# EAGLE design racing_robot (EAGLE 6.1)
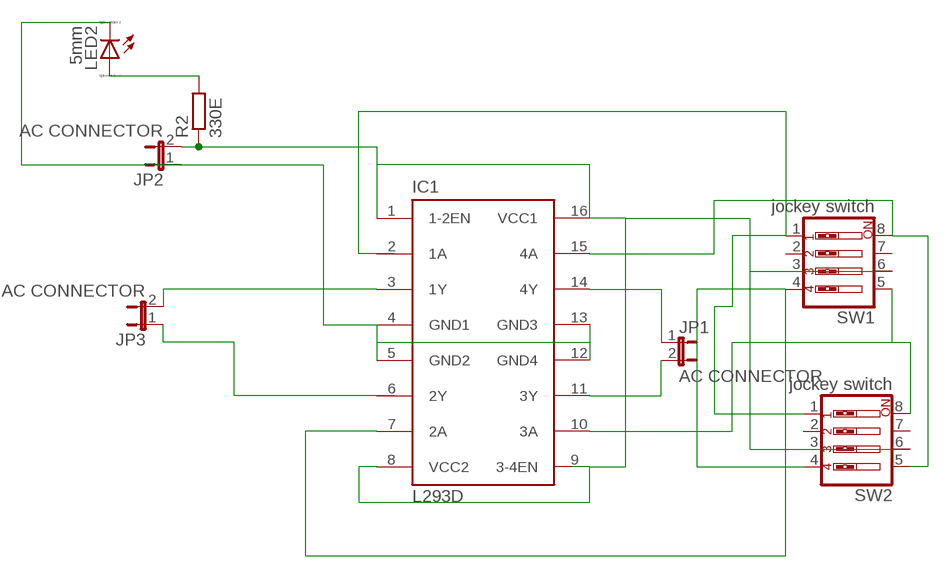
[diagram p0: schematic, sheet 1]

## Parts
IC1  L293D  [DIL16]
JP1  AC CONNECTOR  JP1E  [JP1]
JP2  AC CONNECTOR  JP1E  [JP1]
JP3  AC CONNECTOR  JP1E  [JP1]
LED2  5mm  LED_ELD260  [LED_LD260]
R2  330E  R-EU_0204/7  [0204/7]
SW1  jockey switch  SW_DIP-4  [EDG-04]
SW2  jockey switch  SW_DIP-4  [EDG-04]

## Nets
N$2: LED2.A R2.2
N$3: IC1.4(GND1) IC1.5(GND2) IC1.12(GND4) IC1.13(GND3) JP2.1 LED2.K(C)
N$4: IC1.2(1A) SW1.1 SW2.1
N$6: IC1.6(2Y) JP3.1
N$8: IC1.3(1Y) JP3.2
N$9: IC1.14(4Y) JP1.1
N$10: IC1.11(3Y) JP1.2
N$12: IC1.15(4A) SW1.8 SW2.5
N$13: IC1.7(2A) SW1.4 SW2.4
N$14: IC1.10(3A) SW1.5 SW2.8
N$15: IC1.1(1-2EN) IC1.8(VCC2) IC1.9(3-4EN) IC1.16(VCC1) JP2.2 R2.1 SW1.3 SW1.6 SW2.3 SW2.6
Unconnected: SW1.2 SW1.7 SW2.2 SW2.7

## Library data of the parts
IC1 = st-microelectronics:L293D: PUSH-PULL 4 CHANNEL DRIVER; MPN: L293D; OC_FARNELL: 9589619; OC_NEWARK: 56P8249
JP1-JP3 = jumper:JP1E: JUMPER
LED2 = eagle-ltspice:LED_E: LED Source: http://www.osram.convergy.de Source: www.luxeon.com Source: www.kingbright.com; SPICEMODEL: NONE; SPICEPREFIX: D; SPICETYPE: diode
R2 = rcl:R-EU_: RESISTOR, European symbol
SW1 SW2 = special:SW_DIP-4: DIP SWITCH

## Board
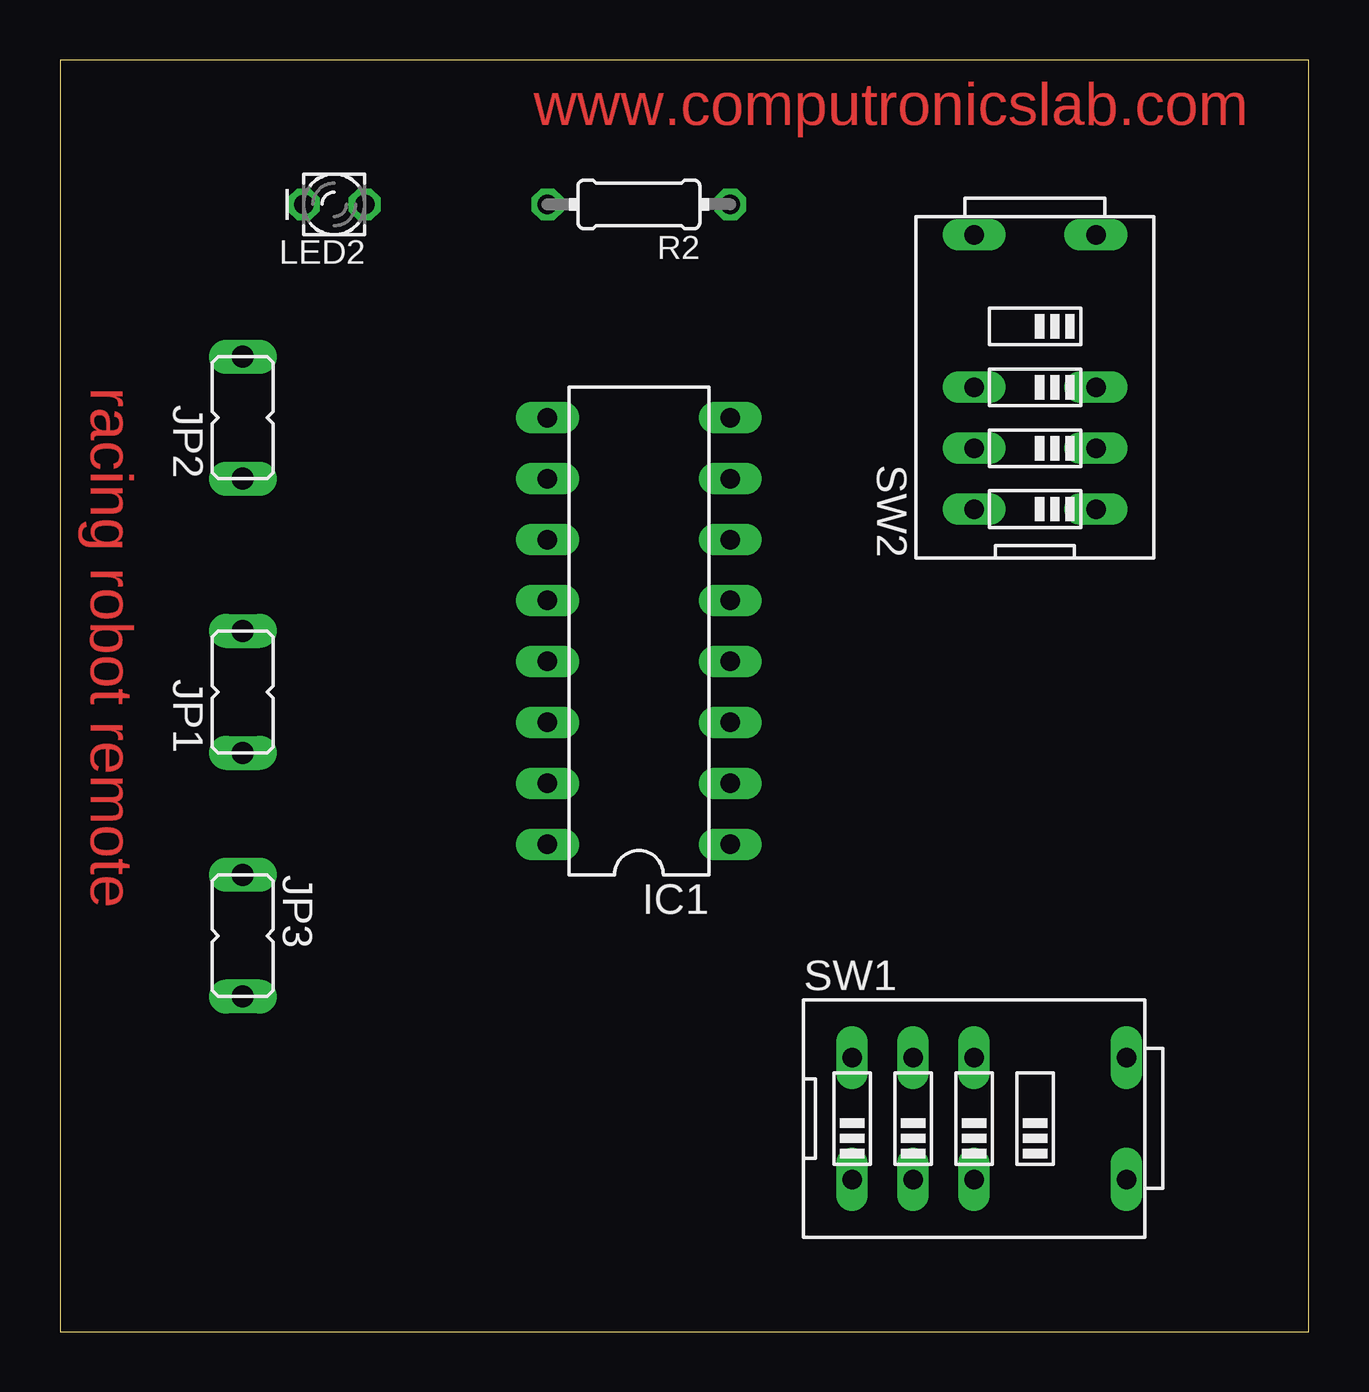
[diagram p1: board, top side]
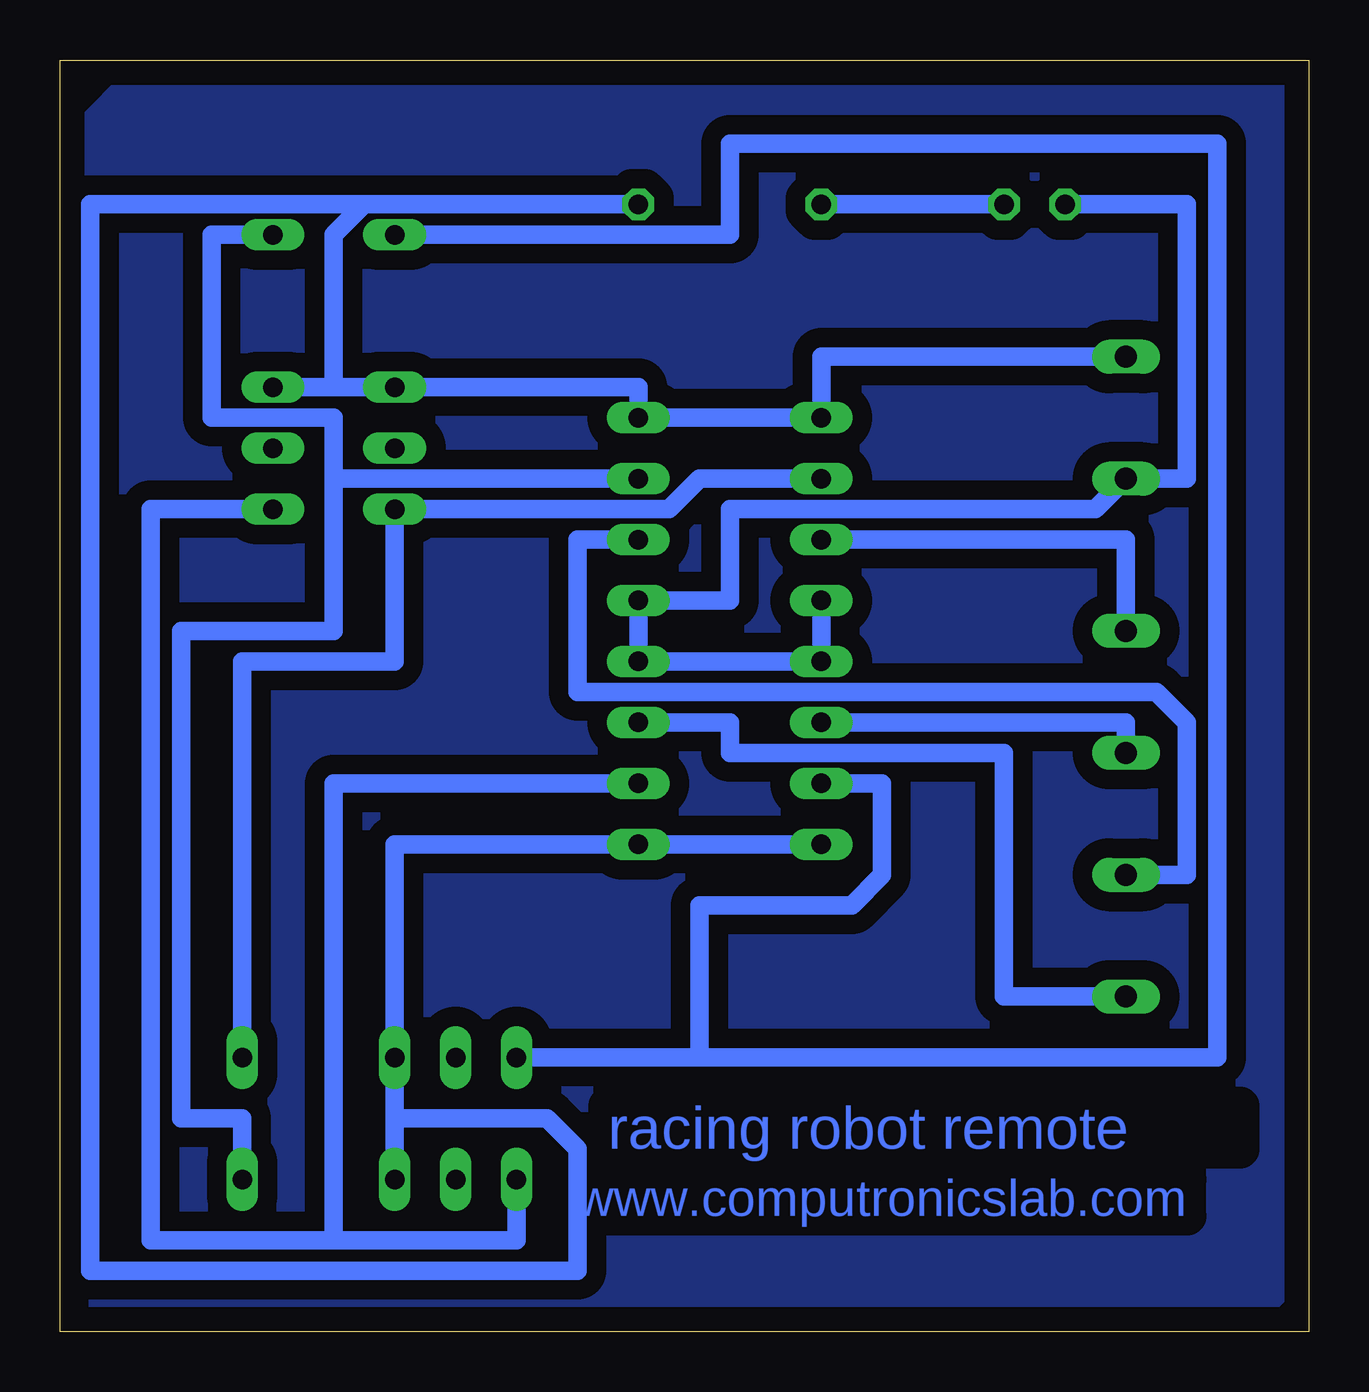
[diagram p2: board, bottom side, seen from below]

Size 52.05 x 53.01 mm. Coordinates in mm from the lower left corner, seen from the top.
Outline: 0,0 52.05,0 52.05,53.01 0,53.01 0,0
Copper layers (1*16): Top 0.035mm / dielectric 1.5mm / Bottom 0.035mm
Design rules: minimum track width 30mil, minimum drill 24mil, track to track 8mil, track to pad 8mil, pad to pad 8mil, via to via 8mil, smd to smd 8mil, copper to edge 40mil, drill to drill 8mil, minimum pad ring 10mil, minimum via ring 8mil, stop-mask expansion 4mil, vias tented up to drill 0mil, thermal gap 10mil

### Footprints (pad centres in the part's own frame; a part is rotated, then mirrored left to right if it is on the bottom)
DIL16 = drill 0.813 long: 1 -8.89,-3.81; 2 -6.35,-3.81; 3 -3.81,-3.81; 4 -1.27,-3.81; 5 1.27,-3.81; 6 3.81,-3.81; 7 6.35,-3.81; 8 8.89,-3.81; 9 8.89,3.81; 10 6.35,3.81; 11 3.81,3.81; 12 1.27,3.81; 13 -1.27,3.81; 14 -3.81,3.81; 15 -6.35,3.81; 16 -8.89,3.81
JP1 = drill 0.914 long: 1 0,-2.54; 2 0,2.54
LED_LD260 = drill 0.813 octagon: A -1.27,0; K 1.27,0
0204/7 = drill 0.813 octagon: 1 -3.81,0; 2 3.81,0
EDG-04 = drill 0.813 long: 1 -3.81,-2.54; 2 -1.27,-2.54; 3 1.27,-2.54; 4 7.62,-2.54; 5 7.62,2.54; 6 1.27,2.54; 7 -1.27,2.54; 8 -3.81,2.54

### Placement (x,y rotation side)
IC1  24.13,29.21 90 top
JP1  7.62,26.67 0 top
JP2  7.62,38.1 0 top
JP3  7.62,16.51 180 top
LED2  11.43,46.99 180 top
R2  24.13,46.99 180 top
SW1  36.83,8.89 0 top
SW2  40.64,38.1 90 top

### Tracks (layer width: path | path; a pad name or v marks a point on that pad's centre or on a via)
N$1
  pour Bottom (isolate 0.813): 7.62,0 2.54,0 0,2.54 0,50.8 2.54,53.34 48.26,53.34 52.07,49.53 52.07,2.54 49.53,0
N$2
  Bottom 0.762: R2.2 LED2.A
N$3
  Bottom 0.762: IC1.12 IC1.13 IC1.4 IC1.5 24.13,30.48 24.13,34.29 8.89,34.29 JP2.1 5.08,35.56 5.08,46.99 LED2.K
N$4
  Bottom 0.762: IC1.2 30.48,22.86 40.64,22.86 40.64,12.7 40.64,3.81 | 40.64,3.81 33.02,3.81 SW1.1 | SW2.1 46.99,34.29 48.26,34.29 48.26,3.81 40.64,3.81
N$6
  Bottom 0.762: IC1.6 30.48,33.02 30.48,26.67 6.35,26.67 5.08,25.4 5.08,19.05 JP3.1
N$8
  Bottom 0.762: IC1.3 24.13,25.4 24.13,24.13 17.78,24.13 12.7,24.13 12.7,13.97 JP3.2
N$9
  Bottom 0.762: IC1.14 7.62,25.4 JP1.1
N$10
  Bottom 0.762: IC1.11 7.62,33.02 JP1.2
N$12
  Bottom 0.762: IC1.15 17.78,22.86 17.78,21.59 17.78,19.05 19.05,17.78 25.4,17.78 25.4,11.43 SW1.8 3.81,11.43 3.81,43.18 3.81,49.53 24.13,49.53 24.13,45.72 SW2.5
N$13
  Bottom 0.762: 40.64,35.56 IC1.7 | 40.64,35.56 40.64,36.83 40.64,38.1 41.91,38.1 44.45,38.1 45.72,38.1 45.72,39.37 45.72,45.72 SW2.4 | SW1.4 44.45,8.89 46.99,8.89 46.99,29.21 40.64,29.21 40.64,31.75 40.64,35.56
N$14
  Bottom 0.762: SW1.5 44.45,27.94 38.1,27.94 38.1,29.21 SW2.8 26.67,34.29 25.4,35.56 IC1.10
N$15
  Bottom 0.762: 38.1,8.89 SW1.6 38.1,20.32 IC1.1 IC1.16 | 38.1,8.89 SW1.3 | SW2.3 40.64,39.37 | 40.64,39.37 SW2.6 27.94,39.37 IC1.8 IC1.9 20.32,40.64 JP2.2 | 39.37,46.99 R2.1 | 39.37,46.99 40.64,45.72 40.64,39.37 | 38.1,8.89 31.75,8.89 30.48,7.62 30.48,2.54 50.8,2.54 50.8,46.99 39.37,46.99

### Text on the board
Top: www.computronicslab.com | racing robot remote
Bottom: racing robot remote | www.computronicslab.com